# Altium schematic sheet circuit2_ver1.SchDoc
size A4
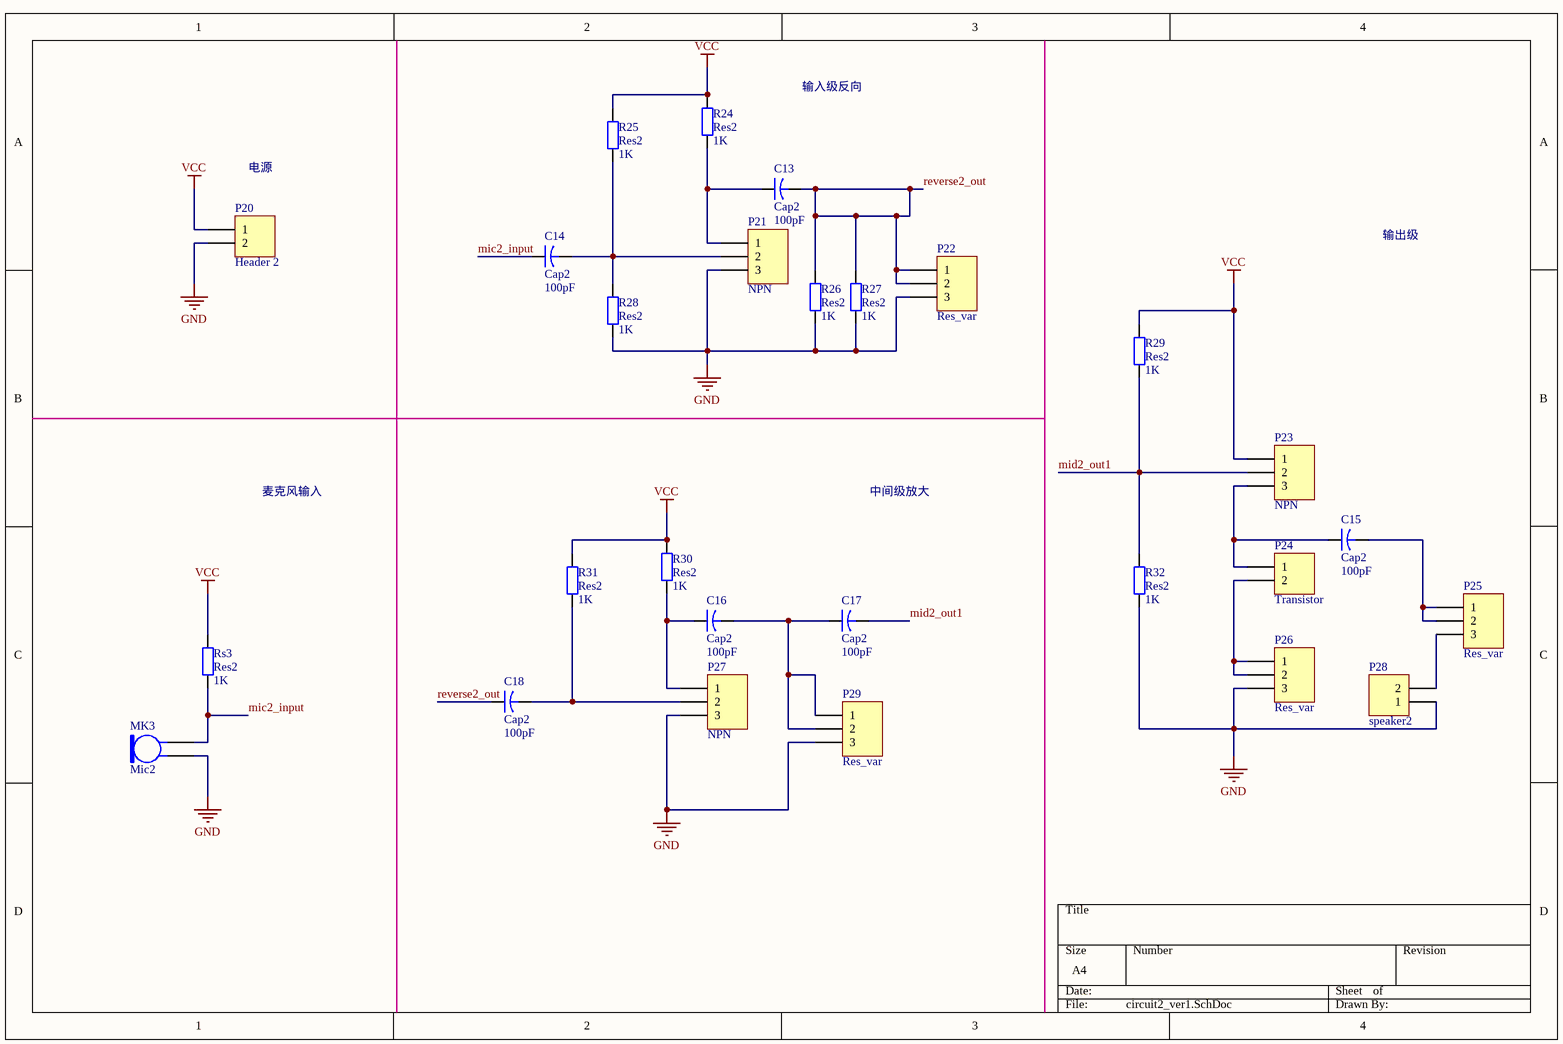
[diagram p0: circuit2_ver1.SchDoc]

## Parts
C13  Cap2  value 100pF  [CAPR5-4X5]
C14  Cap2  value 100pF  [CAPR5-4X5]
C15  Cap2  value 100pF  [CAPR5-4X5]
C16  Cap2  value 100pF  [CAPR5-4X5]
C17  Cap2  value 100pF  [CAPR5-4X5]
C18  Cap2  value 100pF  [CAPR5-4X5]
MK3  Mic2  [PIN2]
P20  Header 2  [HDR1X2]
P21  NPN  [HDR1X3]
P22  Res_var  [HDR1X3]
P23  NPN  [HDR1X3]
P24  Transistor  [HDR1X2]
P25  Res_var  [HDR1X3]
P26  Res_var  [HDR1X3]
P27  NPN  [HDR1X3]
P28  speaker2  [HDR1X2]
P29  Res_var  [HDR1X3]
R24  Res2  value 1K  [AXIAL-0.4]
R25  Res2  value 1K  [AXIAL-0.4]
R26  Res2  value 1K  [AXIAL-0.4]
R27  Res2  value 1K  [AXIAL-0.4]
R28  Res2  value 1K  [AXIAL-0.4]
R29  Res2  value 1K  [AXIAL-0.4]
R30  Res2  value 1K  [AXIAL-0.4]
R31  Res2  value 1K  [AXIAL-0.4]
R32  Res2  value 1K  [AXIAL-0.4]
Rs3  Res2  value 1K  [AXIAL-0.4]

## Nets
GND: MK3.1 P20.2 P21.3 P22.3 P26.3 P27.3 P28.1 P29.3 R26.1 R27.1 R28.1 R32.1
VCC: P20.1 P23.1 R24.2 R25.2 R29.2 R30.2 R31.2 Rs3.2
mic2_input: C14.1 MK3.2 Rs3.1
mid2_out1: C17.2 P23.2 R29.1 R32.2
reverse2_out: C13.2 C18.1 P22.1 P22.2 R26.2 R27.2
NetC13_1: C13.1 P21.1 R24.1
NetC14_2: C14.2 P21.2 R25.1 R28.2
NetC15_1: C15.1 P23.3 P24.1
NetC15_2: C15.2 P25.1 P25.2
NetC16_1: C16.1 P27.1 R30.1
NetC16_2: C16.2 C17.1 P29.1 P29.2
NetC18_2: C18.2 P27.2 R31.1
NetP24_2: P24.2 P26.1 P26.2
NetP25_3: P25.3 P28.2

## Notes on the sheet
- 输入级反向
- 电源
- 输出级
- 麦克风输入
- 中间级放大

## Library data of the parts
C13-C18 = Cap2: Capacitor; Published: 23-Sep-2002; PackageReference: CAPR5-4X5; Publisher: Altium Limited; PackageDescription: Capacitor; 2 Leads
MK3 = Mic2: Microphone; Published: 24-Mar-1999; LatestRevisionDate: 17-Jul-2002; LatestRevisionNote: Re-released for DXP Platform.; PackageReference: PIN2; Publisher: Altium Limited
P20 P24 P28 = Header 2: Header, 2-Pin; LatestRevisionDate: 17-Jul-2002; LatestRevisionNote: Re-released for DXP Platform.; Publisher: Altium Limited
P21-P23 P25-P27 P29 = Header 3: Header, 3-Pin; LatestRevisionDate: 17-Jul-2002; LatestRevisionNote: Re-released for DXP Platform.; Publisher: Altium Limited
R24-R32 Rs3 = Res2: Resistor; Published: 8-Jun-2000; LatestRevisionDate: 17-Jul-2002; LatestRevisionNote: Re-released for DXP Platform.; PackageReference: AXIAL-0.4; Publisher: Altium Limited; PackageDescription: Axial Device, Thru-Hole; 2 Leads; 0.4 in Pin Spacing